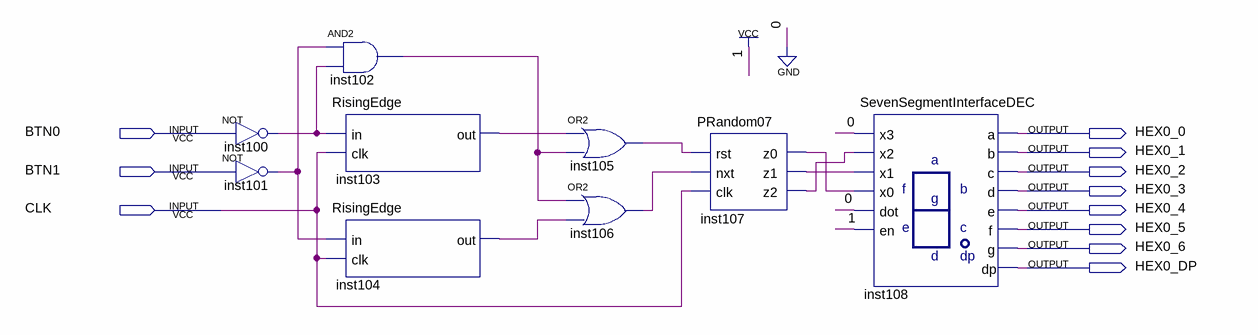
[diagram p0: schematic sheet]
// Quartus schematic dz2.bdf as structural Verilog: 9 symbols, 11 pins
module dz2 (
  input  BTN0,
  input  BTN1,
  input  CLK,
  output HEX0_0,
  output HEX0_1,
  output HEX0_2,
  output HEX0_3,
  output HEX0_4,
  output HEX0_5,
  output HEX0_6,
  output HEX0_DP
);

  wire inst100_out, inst101_out, inst102_out, inst103_output, inst104_output, inst105_out, inst106_out,
       inst107_z0, inst107_z1, inst107_z2;

  not inst100 (inst100_out, BTN0);
  not inst101 (inst101_out, BTN1);
  and inst102 (inst102_out, inst101_out, inst100_out);
  RisingEdge inst103 (.clk(CLK), .\input (inst100_out), .\output (inst103_output));
  RisingEdge inst104 (.clk(CLK), .\input (inst101_out), .\output (inst104_output));
  or inst105 (inst105_out, inst103_output, inst102_out);
  or inst106 (inst106_out, inst102_out, inst104_output);
  PRandom07 inst107 (
    .rst(inst105_out), .nxt(inst106_out), .clk(CLK), .z0(inst107_z0), .z1(inst107_z1), .z2(inst107_z2));
  SevenSegmentInterfaceDEC inst108 (
    .x3(1'b0), .x2(inst107_z2), .x1(inst107_z1), .x0(inst107_z0), .dot(1'b0), .en(1'b1), .a(HEX0_0),
    .b(HEX0_1), .c(HEX0_2), .d(HEX0_3), .e(HEX0_4), .f(HEX0_5), .g(HEX0_6), .dp(HEX0_DP));
endmodule
